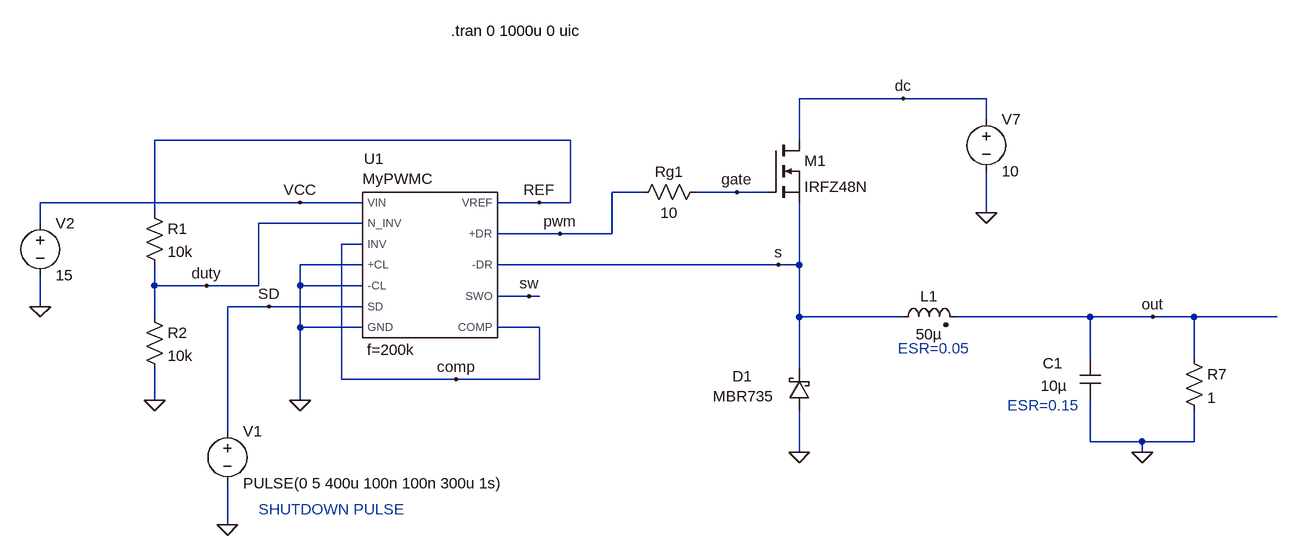
[diagram p0: schematic MyPWMC - buck test.asc]
MyPWMC - buck test.asc, the LTspice schematic file:
Version 4
SHEET 1 2084 1268
WIRE 1504 -96 1344 -96
WIRE 1632 -96 1504 -96
WIRE 1632 -64 1632 -96
WIRE 992 -32 352 -32
WIRE 1344 -32 1344 -96
WIRE 1104 48 1056 48
WIRE 1248 48 1184 48
WIRE 1296 48 1248 48
WIRE 576 64 176 64
WIRE 672 64 576 64
WIRE 944 64 880 64
WIRE 992 64 992 -32
WIRE 992 64 944 64
WIRE 352 80 352 -32
WIRE 1632 80 1632 16
WIRE 176 96 176 64
WIRE 672 96 512 96
WIRE 976 112 880 112
WIRE 1056 112 1056 48
WIRE 1056 112 976 112
WIRE 672 128 640 128
WIRE 672 160 576 160
WIRE 1312 160 880 160
WIRE 1344 160 1344 64
WIRE 1344 160 1312 160
WIRE 352 192 352 160
WIRE 432 192 352 192
WIRE 512 192 512 96
WIRE 512 192 432 192
WIRE 576 192 576 160
WIRE 672 192 576 192
WIRE 928 208 880 208
WIRE 944 208 928 208
WIRE 176 224 176 176
WIRE 528 224 464 224
WIRE 672 224 528 224
WIRE 352 240 352 192
WIRE 1344 240 1344 160
WIRE 1504 240 1344 240
WIRE 1792 240 1584 240
WIRE 1888 240 1792 240
WIRE 1952 240 1888 240
WIRE 2080 240 1952 240
WIRE 576 256 576 192
WIRE 672 256 576 256
WIRE 944 256 880 256
WIRE 1792 304 1792 240
WIRE 1952 304 1952 240
WIRE 1344 320 1344 240
WIRE 640 336 640 128
WIRE 816 336 640 336
WIRE 944 336 944 256
WIRE 944 336 816 336
WIRE 352 368 352 320
WIRE 576 368 576 256
WIRE 464 416 464 224
WIRE 1792 432 1792 368
WIRE 1872 432 1792 432
WIRE 1952 432 1952 384
WIRE 1952 432 1872 432
WIRE 1344 448 1344 384
WIRE 1872 448 1872 432
WIRE 464 560 464 496
FLAG 176 224 0
FLAG 352 368 0
FLAG 1632 80 0
FLAG 1248 48 gate
FLAG 1872 448 0
FLAG 1888 240 out
FLAG 1344 448 0
FLAG 1504 -96 dc
FLAG 576 64 VCC
FLAG 576 368 0
FLAG 944 64 REF
FLAG 432 192 duty
FLAG 816 336 comp
FLAG 976 112 pwm
FLAG 1312 160 s
FLAG 928 208 sw
FLAG 464 560 0
FLAG 528 224 SD
SYMBOL voltage 176 80 R0
WINDOW 123 0 0 Left 0
WINDOW 39 0 0 Left 0
SYMATTR InstName V2
SYMATTR Value 15
SYMBOL res 336 64 R0
SYMATTR InstName R1
SYMATTR Value 10k
SYMBOL res 336 224 R0
SYMATTR InstName R2
SYMATTR Value 10k
SYMBOL voltage 1632 -80 R0
WINDOW 123 0 0 Left 2
WINDOW 39 0 0 Left 2
SYMATTR InstName V7
SYMATTR Value 10
SYMBOL nmos 1296 -32 R0
SYMATTR InstName M1
SYMATTR Value IRFZ48N
SYMBOL res 1088 64 R270
WINDOW 0 32 56 VTop 2
WINDOW 3 0 56 VBottom 2
SYMATTR InstName Rg1
SYMATTR Value 10
SYMBOL schottky 1360 384 R180
WINDOW 0 88 53 Left 2
WINDOW 3 55 22 Left 2
SYMATTR InstName D1
SYMATTR Value MBR735
SYMATTR Description Diode
SYMATTR Type diode
SYMBOL cap 1776 304 R0
WINDOW 0 -57 7 Left 2
WINDOW 3 -60 42 Left 2
SYMATTR InstName C1
SYMATTR Value 10µ
SYMATTR SpiceLine Rser=0.15
SYMBOL res 1936 288 R0
SYMATTR InstName R7
SYMATTR Value 1
SYMBOL ind2 1488 256 R270
WINDOW 0 32 56 VTop 2
WINDOW 3 5 56 VBottom 2
SYMATTR InstName L1
SYMATTR Value 50µ
SYMATTR Type ind
SYMATTR SpiceLine Rser=0.05
SYMBOL MyPWMC 752 160 R0
WINDOW 0 -62 -148 Bottom 2
WINDOW 38 -26 -117 Bottom 2
WINDOW 3 -36 146 Bottom 2
SYMATTR InstName U1
SYMATTR Value f=200k
SYMBOL voltage 464 400 R0
WINDOW 123 0 0 Left 0
WINDOW 39 0 0 Left 0
SYMATTR InstName V1
SYMATTR Value PULSE(0 5 400u 100n 100n 300u 1s)
TEXT 808 -200 Left 2 !.tran 0 1000u 0 uic
TEXT 1664 376 Left 2 ;ESR=0.15
TEXT 1496 288 Left 2 ;ESR=0.05
TEXT 512 536 Left 2 ;SHUTDOWN PULSE

The netlist it stands for:
* MyPWMC - buck test.asc
V2 VCC 0 15
R1 REF duty 10k
R2 duty 0 10k
V7 dc 0 10
M1 dc gate s s IRFZ48N
Rg1 pwm gate 10
D1 0 s MBR735
C1 out 0 10µ Rser=0.15
R7 out 0 1
L1 s out 50µ Rser=0.05
XU1 VCC duty comp 0 0 SD 0 comp sw s pwm REF MyPWMC f=200k  ; pins VIN N_INV INV +CL -CL SD GND COMP SWO -DR +DR VREF
V1 SD 0 PULSE(0 5 400u 100n 100n 300u 1s)
.model D D
.lib standard.dio
.model NMOS NMOS
.model PMOS PMOS
.lib standard.mos
.tran 0 1000u 0 uic
* ESR=0.15
* ESR=0.05
* SHUTDOWN PULSE
.lib MyPWMC.sub
.backanno
.end